# Altium schematic sheet mux.SchDoc: A 24-bit AD7714YRZ Analog-to-Digital Converter
size A4
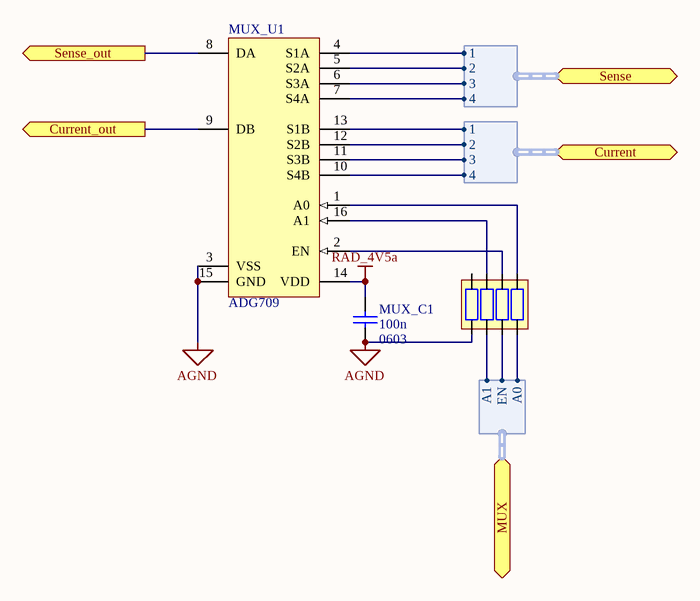
[diagram p0: mux.SchDoc]

## Parts
MUX_C1  value 100n  Package: 0603  [SMD_Capacitor_0603]  (hidden comment: Cap)
MUX_R1  YC124-JR-072K2L  [SMD_RESISTOR_ARRAY_YC124]  (value not drawn)
MUX_U1  ADG709  [TSSOP16]

## Ports
Current (harness ADG709_MUX_CH), Current_out (out), MUX (harness ADG709_MUX), Sense (harness ADG709_MUX_CH), Sense_out (out)

## Harnesses
ADG709_MUX: A0, A1, EN
ADG709_MUX_CH: 1, 2, 3, 4
ADG709_MUX_CH: 2, 3, 4, 1

## Nets
AGND: MUX_C1.2 MUX_R1.1 MUX_U1.3(VSS) MUX_U1.15(GND)
RAD_4V5a: MUX_C1.1 MUX_U1.14(VDD)
Current_out: MUX_U1.9(DB) ; port Current_out
Sense_out: MUX_U1.8(DA) ; port Sense_out
NetMUX_R1_2: MUX_R1.2 ; port MUX.A1
NetMUX_R1_3: MUX_R1.3 ; port MUX.EN
NetMUX_R1_4: MUX_R1.4 ; port MUX.A0
NetMUX_R1_5: MUX_R1.5 MUX_U1.1(A0)
NetMUX_R1_6: MUX_R1.6 MUX_U1.2(EN)
NetMUX_R1_7: MUX_R1.7 MUX_U1.16(A1)
NetMUX_U1_4: MUX_U1.4(S1A) ; port Sense.1
NetMUX_U1_5: MUX_U1.5(S2A) ; port Sense.2
NetMUX_U1_6: MUX_U1.6(S3A) ; port Sense.3
NetMUX_U1_7: MUX_U1.7(S4A) ; port Sense.4
NetMUX_U1_10: MUX_U1.10(S4B) ; port Current.4
NetMUX_U1_11: MUX_U1.11(S3B) ; port Current.3
NetMUX_U1_12: MUX_U1.12(S2B) ; port Current.2
NetMUX_U1_13: MUX_U1.13(S1B) ; port Current.1

Not connected (* = marked no-connect by the designer): MUX_R1 8

## Notes on the sheet
- Title:
- Sheet:
- of
- Author:
- Model:
- Document Number:
- Checked by:
- Iss-Rev:
- Approved by:
- Date:
- File name:

## Library data of the parts
MUX_R1 = YC124-JR-072K2L: RESISTOR ARRAY, 4 x 0402; URL: http://pl.farnell.com/yageo-phycomp/yc124-jr-072k2l/resistor-array-arv341-4-x-0402/dp/9235388
MUX_U1 = ADG709: CMOS Analog 4-Channel Multiplexer; Manufacturer: Analog Devices; ManufacturerPartNumber: ADG709